# Altium schematic sheet Artic.SchDoc
size 431 x 279 mm; DocumentNumber: 2; SheetNumber: 2; SheetTotal: 7
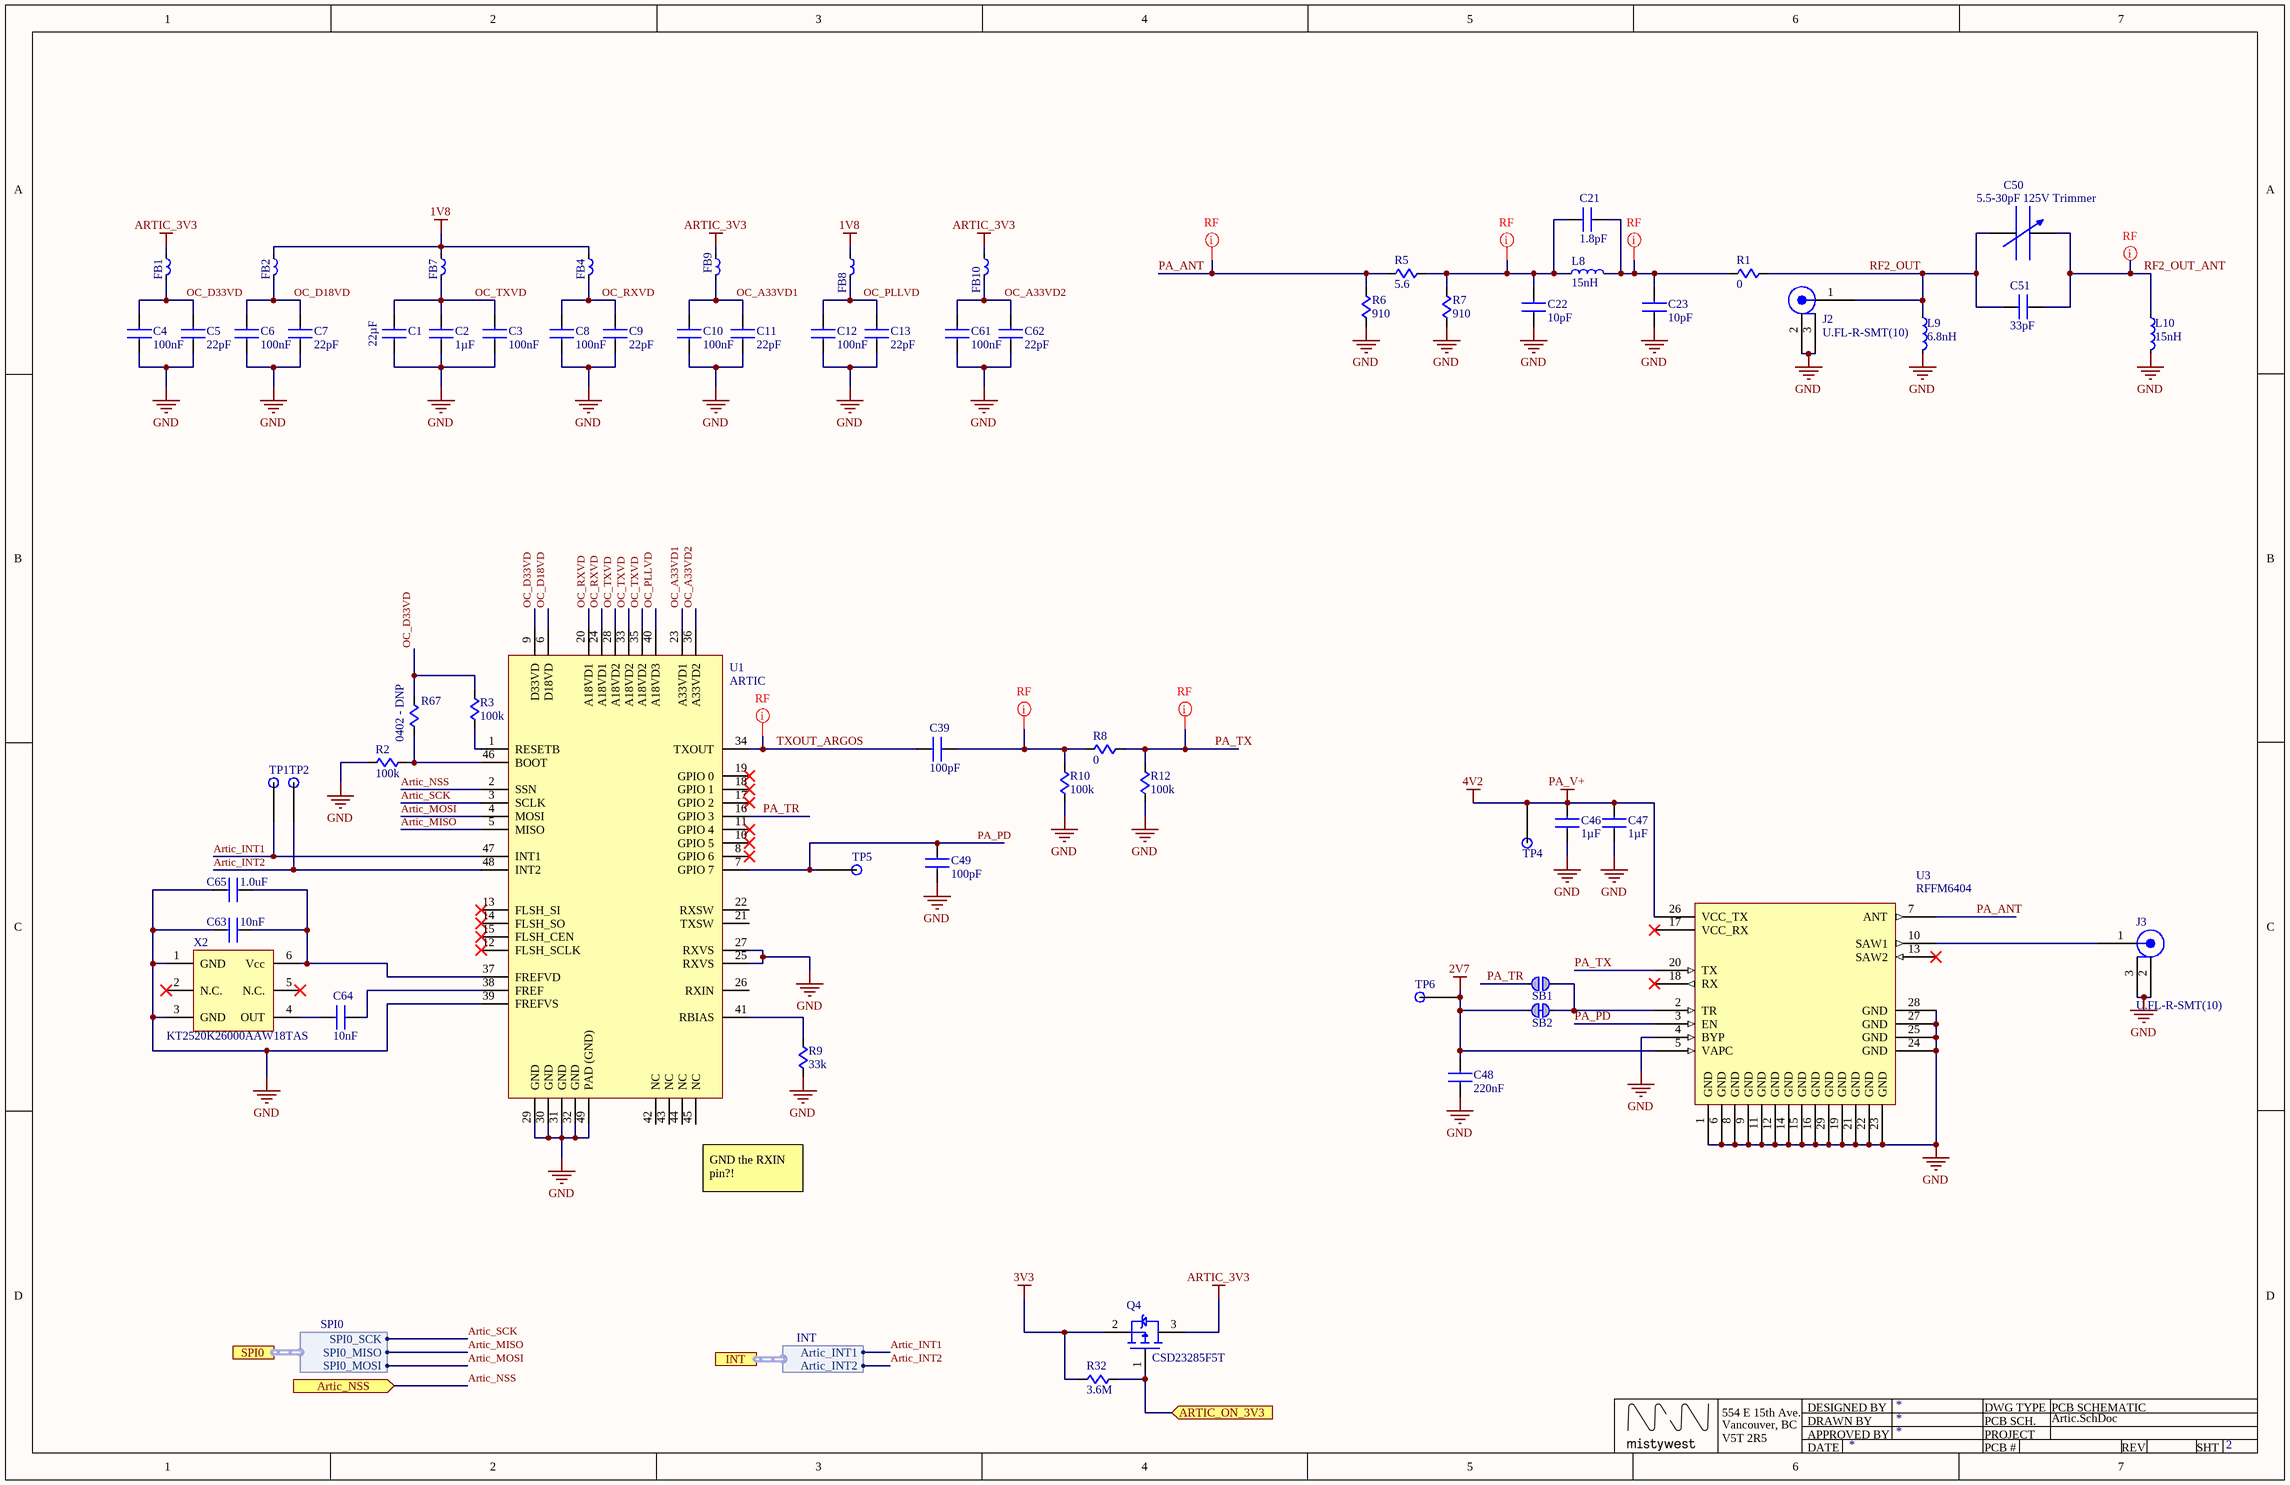
[diagram p0: Artic.SchDoc]

## Parts
C1  22µF  [CAPC1608N-0603]
C2  1µF  [CAPC1005N-0402]
C3  100nF  [CAPC1005N-0402]
C4  100nF  [CAPC1005N-0402]
C5  22pF  [CAPC1005N-0402]
C6  100nF  [CAPC1005N-0402]
C7  22pF  [CAPC1005N-0402]
C8  100nF  [CAPC1005N-0402]
C9  22pF  [CAPC1005N-0402]
C10  100nF  [CAPC1005N-0402]
C11  22pF  [CAPC1005N-0402]
C12  100nF  [CAPC1005N-0402]
C13  22pF  [CAPC1005N-0402]
C21  1.8pF  [CAPC1005N-0402]
C22  10pF  [CAPC1005N-0402]
C23  10pF  [CAPC1005N-0402]
C39  100pF  [CAPC1005N-0402]
C46  1µF  [CAPC1005N-0402]
C47  1µF  [CAPC1005N-0402]
C48  220nF  [CAPC1005N-0402]
C49  100pF  [CAPC1005N-0402]
C50  5.5-30pF 125V Trimmer  [CAPC4531X17N]
C51  33pF  [CAPC1005N-0402]
C61  100nF  [CAPC1005N-0402]
C62  22pF  [CAPC1005N-0402]
C63  10nF  [CAPC1005N-0402]
C64  10nF  [CAPC1005N-0402]
C65  1.0uF  [CAPC1608N-0603]
FB1  BLM15AG221SN1D  [MURA-BLM15-CHIP-2_V]  (value not drawn)
FB2  BLM15AG221SN1D  [MURA-BLM15-CHIP-2_V]  (value not drawn)
FB4  BLM15AG221SN1D  [MURA-BLM15-CHIP-2_V]  (value not drawn)
FB7  BLM15AG221SN1D  [MURA-BLM15-CHIP-2_V]  (value not drawn)
FB8  BLM15AG221SN1D  [MURA-BLM15-CHIP-2_V]  (value not drawn)
FB9  BLM15AG221SN1D  [MURA-BLM15-CHIP-2_V]  (value not drawn)
FB10  BLM15AG221SN1D  [MURA-BLM15-CHIP-2_V]  (value not drawn)
J2  mfg_pn: U.FL-R-SMT(10)  [con_hrs_U_FL-SMT]  (hidden comment: CONNECTOR COAX-M 2GND)
J3  mfg_pn: U.FL-R-SMT(10)  [con_hrs_U_FL-SMT]  (hidden comment: CONNECTOR COAX-M 2GND)
L8  15nH  [LQW2BA]
L9  6.8nH  [0603HP]
L10  15nH  [0603HP]
Q4  CSD23285F5T  [3-XFDFN]
R1  0  [RESC0402(1005)_N]
R2  100k  [RESC0402(1005)_N]
R3  100k  [RESC0402(1005)_N]
R5  5.6  [Chip Res 1608_0603 MMC]
R6  910  [Chip Res 1608_0603 MMC]
R7  910  [Chip Res 1608_0603 MMC]
R8  0  [RESC0402(1005)_N]
R9  33k  [RESC0402(1005)_N]
R10  100k  [RESC0402(1005)_N]
R12  100k  [RESC0402(1005)_N]
R32  3.6M  [RESC0402(1005)_N]
R67  0402 - DNP  [RESC0402(1005)_N]  (no BOM)
SB1  Solder Bridge Open - 50mil  [Solder_Bridge_Open_50]  (value not drawn)  (net tie, no BOM)
SB2  Solder Bridge Closed - 50mil  [Solder_Bridge_Closed_50]  (value not drawn)  (net tie, no BOM)
TP1  (no value)  [Testpoint_16mil_32mil]  (no BOM)
TP2  (no value)  [Testpoint_16mil_32mil]  (no BOM)
TP4  (no value)  [Testpoint_16mil_32mil]  (no BOM)
TP5  (no value)  [Testpoint_16mil_32mil]  (no BOM)
TP6  (no value)  [Testpoint_16mil_32mil]  (no BOM)
U1  ARTIC  [QFN, 48-Lead]
U3  RFFM6404  [LGA28C100P8X8_600X600X105]
X2  KT2520K26000AAW18TAS  [KT2520]

## Ports
Artic_NSS (in), ARTIC_ON_3V3 (in), INT (harness INT), SPI0 (harness SPI0)

## Harnesses
SPI0: SPI0_SCK, SPI0_MISO, SPI0_MOSI
INT: Artic_INT1, Artic_INT2

## Nets
1V8: FB2.1 FB4.1 FB7.1 FB8.1
2V7: C48.1 SB2.2 TP6.TP U3.5(VAPC)
3V3: Q4.2(Source) R32.1
4V2: C46.1 C47.1 TP4.TP U3.26(VCC_TX)  [also labelled PA_V+]
ARTIC_3V3: FB1.1 FB9.1 FB10.1 Q4.3(Drain)
GND: C1.2 C2.2 C3.2 C4.2 C5.2 C6.2 C7.2 C8.2 C9.2 C10.2 C11.2 C12.2 C13.2 C22.2 C23.2 C46.2 C47.2 C48.2 C49.1 C61.2 C62.2 C63.1 C65.1 J2.2(SHIELD) J2.3(SHIELD2) J3.2(SHIELD) J3.3(SHIELD2) L9.2 L10.2 R2.2 R6.1 R7.1 R9.1 R10.1 R12.1 U1.25(RXVS) U1.27(RXVS) U1.29(GND) U1.30(GND) U1.31(GND) U1.32(GND) U1.39(FREFVS) U1.49(PAD_(GND)) U3.1(GND) U3.4(BYP) U3.6(GND) U3.8(GND) U3.9(GND) U3.11(GND) U3.12(GND) U3.14(GND) U3.15(GND) U3.16(GND) U3.19(GND) U3.21(GND) U3.22(GND) U3.23(GND) U3.24(GND) U3.25(GND) U3.27(GND) U3.28(GND) U3.29(GND) X2.1(GND) X2.3(GND)
Artic_INT1: TP1.TP U1.47(INT1) ; port INT.Artic_INT1
Artic_INT2: TP2.TP U1.48(INT2) ; port INT.Artic_INT2
Artic_MISO: U1.5(MISO) ; port SPI0.SPI0_MISO
Artic_MOSI: U1.4(MOSI) ; port SPI0.SPI0_MOSI
Artic_NSS: U1.2(SSN) ; port Artic_NSS
ARTIC_ON_3V3: Q4.1(Gate) R32.2 ; port ARTIC_ON_3V3
Artic_SCK: U1.3(SCLK) ; port SPI0.SPI0_SCK
OC_A33VD1: C10.1 C11.1 FB9.2 U1.23(A33VD1)
OC_A33VD2: C61.1 C62.1 FB10.2 U1.36(A33VD2)
OC_D18VD: C6.1 C7.1 FB2.2 U1.6(D18VD)
OC_D33VD: C4.1 C5.1 FB1.2 R3.2 R67.2 U1.9(D33VD)
OC_PLLVD: C12.1 C13.1 FB8.2 U1.40(A18VD3)
OC_RXVD: C8.1 C9.1 FB4.2 U1.20(A18VD1) U1.24(A18VD1)
OC_TXVD: C1.1 C2.1 C3.1 FB7.2 U1.28(A18VD2) U1.33(A18VD2) U1.35(A18VD2)
PA_ANT: R5.1 R6.2 U3.7(ANT)
PA_PD: C49.2 TP5.TP U1.7(GPIO_7) U3.3(EN)
PA_TR: SB1.2 U1.16(GPIO_3)
PA_TX: R8.2 R12.2 U3.20(TX)
RF2_OUT: C50.1 C51.1 J2.1(CENTER) L9.1 R1.2
RF2_OUT_ANT: C50.2 C51.2 L10.1
TXOUT_ARGOS: C39.1 U1.34(TXOUT)
NetC21_1: C21.1 C22.1 L8.1 R5.2 R7.2
NetC21_2: C21.2 C23.1 L8.2 R1.1
NetC39_2: C39.2 R8.1 R10.2
NetC63_2: C63.2 C65.2 U1.37(FREFVD) X2.6(Vcc)
NetC64_1: C64.1 X2.4(OUT)
NetC64_2: C64.2 U1.38(FREF)
NetJ3_1: J3.1(CENTER) U3.10(SAW1)
NetR2_1: R2.1 R67.1 U1.46(BOOT)
NetR3_1: R3.1 U1.1(RESETB)
NetR9_2: R9.2 U1.41(RBIAS)
NetSB1_1: SB1.1 SB2.1 U3.2(TR)

Not connected (* = marked no-connect by the designer): U1 8(GPIO_6)* 10(GPIO_5)* 11(GPIO_4)* 12(FLSH_SCLK)* 13(FLSH_SI)* 14(FLSH_SO)* 15(FLSH_CEN)* 17(GPIO_2)* 18(GPIO_1)* 19(GPIO_0)* 21(TXSW) 22(RXSW) 26(RXIN) 42(NC) 43(NC) 44(NC) 45(NC); U3 13(SAW2)* 17(VCC_RX)* 18(RX)*; X2 2(N.C.)* 5(N.C.)*

## Layout directives
net class RF: NetC21_1, NetC21_2, NetC39_2, PA_ANT, PA_TX, RF2_OUT_ANT, TXOUT_ARGOS

## Notes on the sheet
- (near U1) GND the RXIN pin?!
- 554 E 15th Ave.
- Vancouver, BC
- PCB SCHEMATIC
- V5T 2R5
- DESIGNED BY
  DRAWN BY
  APPROVED BY
  DATE
- DWG TYPE
  PCB SCH.
  PROJECT
  PCB #
- REV  =Revision
- SHT  =SheetNumber OF =SheetTotal

## Library data of the parts
C1 = CMP-03705-2: CAP CER 22UF 6.3V X5R 0603 ±10%; Manufacturer: Samsung Electro-Mechanics America, Inc.; Manufacturer Part Number: CL10A226KQ8NRNE; Capacitance: 22µF; Temperature Coefficient: X5R; Tolerance: ±10%; Voltage: 6.3V
C2 C46 C47 = CMP-02706-4: CAP CER 1UF 6.3V X7R 0402 ±10%; Manufacturer: Samsung Electro-Mechanics America, Inc.; Manufacturer Part Number: CL05B105KQ5NQNC; RevisionId: 2; AccessRights: 2147483647; Folder: MW_Parts\Components\Capacitors\Ceramic\Ceramic Filters\0402\X7R\; ContentType: Component; AncestorItemRevisionGUID: FD93AFD0-5032-408C-A550-1F4FCEC40B04; LifeCycleStateGUID: 706004B5-C76E-482E-903B-BA0E4FAE086A; ReleaseDate: 21/08/2017 11:02:52 PM; ContentTypeGUID: CB3C11C4-E317-11DF-B822-12313F0024A2; ItemGUID: 5B2E3594-B687-4FDE-A8F8-DCF9F15A9421; ItemHRID: CMP-02706; FolderGUID: EC3CA227-945F-4B62-A70C-0C1E94DF012A; LifeCycle: Draft; ComponentType: Capacitor; Capacitance: 1µF; Temperature Coefficient: X7R; Tolerance: ±10%; Voltage: 6.3V
C3 C4 C6 C8 C10 C12 C61 = CMP-02680-4: CAP CER 0.1UF 10V X7R 0402 ±5%; Manufacturer: Samsung Electro-Mechanics America, Inc.; Manufacturer Part Number: CL05B104JP5NNNC; RevisionId: 2; AccessRights: 2147483647; Folder: MW_Parts\Components\Capacitors\Ceramic\Ceramic Filters\0402\X7R\; ContentType: Component; AncestorItemRevisionGUID: B5B9AEA9-2888-4609-98C5-D2A143A2E055; LifeCycleStateGUID: 706004B5-C76E-482E-903B-BA0E4FAE086A; ReleaseDate: 21/08/2017 11:02:50 PM; ContentTypeGUID: CB3C11C4-E317-11DF-B822-12313F0024A2; ItemGUID: 98D0CBC0-CD69-4B1B-A7E9-949A7B6C034B; ItemHRID: CMP-02680; FolderGUID: EC3CA227-945F-4B62-A70C-0C1E94DF012A; LifeCycle: Draft; ComponentType: Capacitor; Capacitance: 100nF; Temperature Coefficient: X7R; Tolerance: ±5%; Voltage: 10V
C5 C7 C9 C11 C13 C62 = CMP-02804-2: CAP CER 22PF 50V C0G/NP0 0402 ±5%; Manufacturer: Samsung Electro-Mechanics America, Inc.; Manufacturer Part Number: CL05C220JB5NNNC; Temperature Coefficient: C0G, NP0; Capacitance: 22pF; Tolerance: ±5%; Voltage: 50V
C21 = CMP-02769-2: CAP CER 1.8PF 50V C0G/NP0 0402 ±0.25pF; Manufacturer: Samsung Electro-Mechanics America, Inc.; Manufacturer Part Number: CL05C1R8CB5NNNC; Temperature Coefficient: C0G, NP0; Capacitance: 1.8pF; Tolerance: ±0.25pF; Voltage: 50V
C22 C23 = CMP-02776-2: CAP CER 10PF 50V C0G/NP0 0402 ±0.25pF; Manufacturer: Samsung Electro-Mechanics America, Inc.; Manufacturer Part Number: CL05C100CB5NNNC; Temperature Coefficient: C0G, NP0; Capacitance: 10pF; Tolerance: ±0.25pF; Voltage: 50V
C39 C49 = CMP-02879-2: CAP CER 100PF 50V C0G/NP0 0402 ±5% AEC-Q200; Manufacturer: Samsung Electro-Mechanics America, Inc.; Manufacturer Part Number: CL05C101JB51PNC; Temperature Coefficient: C0G, NP0; Capacitance: 100pF; Tolerance: ±5%; Voltage: 50V
C48 = CMP-02685-4: CAP CER 0.22UF 10V X7R 0402 ±10%; Manufacturer: Samsung Electro-Mechanics America, Inc.; Manufacturer Part Number: CL05B224KP5NNNC; RevisionId: 2; AccessRights: 2147483647; Folder: MW_Parts\Components\Capacitors\Ceramic\Ceramic Filters\0402\X7R\; ContentType: Component; AncestorItemRevisionGUID: 19ED1FDF-9501-448A-B921-9E0B872992DD; LifeCycleStateGUID: 706004B5-C76E-482E-903B-BA0E4FAE086A; ReleaseDate: 21/08/2017 11:02:36 PM; ContentTypeGUID: CB3C11C4-E317-11DF-B822-12313F0024A2; ItemGUID: F74CCC9D-90D1-403A-981F-F79E304EBD0F; ItemHRID: CMP-02685; FolderGUID: EC3CA227-945F-4B62-A70C-0C1E94DF012A; LifeCycle: Draft; ComponentType: Capacitor; Capacitance: 220nF; Temperature Coefficient: X7R; Tolerance: ±10%; Voltage: 10V
C50 = CMP-04735-1: CAP TRIMMER 5.5-30PF 125V SMD; Manufacturer: Knowles Voltronics; Manufacturer Part Number: JR300; Capacitance: 30pF; Temperature Coefficient: -1500 +/- 1000; Tolerance: + 100% - 0%; Voltage Rating: 100V; Q Factor: 1500; Test Frequency: 1MHz; Voltage: 125V; Min Operating Temperature: -40°C; Max Operating Temperature: 85°C; Packaging: Tape and Reel; Package Quantity: 1000; Termination: SMD/SMT; Resistor Type: Ceramic; Voltage Rating (DC): 100V; Length: 0.138inch; Height: 0.045inch; Width: 0.122inch
C51 = CMP-02818-2: CAP CER 33PF 50V C0G/NP0 0402 ±5%; Manufacturer: Samsung Electro-Mechanics America, Inc.; Manufacturer Part Number: CL05C330JB5NNNC; Temperature Coefficient: C0G, NP0; Tolerance: ±5%; Voltage: 50V; Capacitance: 33pF
C63 C64 = CMP-02688-4: CAP CER 10000PF 10V X7R 0402 ±10%; Manufacturer: Samsung Electro-Mechanics America, Inc.; Manufacturer Part Number: CL05B103KP5NNNC; RevisionId: 2; AccessRights: 2147483647; Folder: MW_Parts\Components\Capacitors\Ceramic\Ceramic Filters\0402\X7R\; ContentType: Component; AncestorItemRevisionGUID: FBEF5854-9E39-482B-85E2-851CE328D631; LifeCycleStateGUID: 706004B5-C76E-482E-903B-BA0E4FAE086A; ReleaseDate: 21/08/2017 11:02:51 PM; ContentTypeGUID: CB3C11C4-E317-11DF-B822-12313F0024A2; ItemGUID: 32F95929-C4EE-43CA-91BC-E7F6B815331F; ItemHRID: CMP-02688; FolderGUID: EC3CA227-945F-4B62-A70C-0C1E94DF012A; LifeCycle: Draft; ComponentType: Capacitor; Capacitance: 10nF; Temperature Coefficient: X7R; Tolerance: ±10%; Voltage: 10V
C65 = CMP-00018-5: CAP CER 1.0uF 6.3V X7R 0603 ±10%; Manufacturer: Samsung Electro-Mechanics America, Inc.; Manufacturer Part Number: CL10B105KQ8NNN; Capacitance: 1µF; Temperature Coefficient: X7R; Voltage: 6.3V; Tolerance: ±10%
FB1 FB2 FB4 FB7-FB10 = CMP-04113-4: Chip Ferrite Bead for General Use, 220 Ohm, 450 mA, -55 to 125 degC, 1 x 0.5 x 0.55 mm SMD, Tape and Reel; Manufacturer: Murata; Manufacturer Part Number: BLM15AG221SN1D
J2 J3 = CMP-008-0021-3: CONN RECPT ULTRA-MINI COAX SMD; dist: DIGIKEY; dist_pn: H9161CT-ND; mfg: HIROSE; positions: 1; source_package: U_FL; Body Material: Bronze; Plating: Silver; Dielectric Material: Polymer; Impedance: 50R; Connector Type: Coaxial,Receptacle,Male Pin; Max Frequency: 6GHz; Component Name: CONNECTOR COAX-M 2GND; height: 1.25MM; part_type: connector; status: Unknown; Manufacturer: HIROSE; Manufacturer Part Number: U.FL-R-SMT(10); Mount: Surface Mount; Case/Package: SMD/SMT; Contact Material: Brass; Contact Plating: Gold; Body Plating: Silver; Housing Color: Beige; Min Operating Temperature: -40°C; Max Operating Temperature: 90°C; Package Quantity: 1; Fastening Type: Snap; Packaging: Tape and Reel; Termination: Solder; Frequency: 6GHz; Orientation: Vertical; Length: 3mm; Depth: 3.1mm; Radiation Hardening: No; Lead Free: Lead Free
L8 = CMP-04583-1: FIXED IND 15NH 1.5A 120 MOHM; Manufacturer: MuRata; Manufacturer Part Number: LQW2BAN15NG00L; DC Resistance: 0.12; Current Rating: 1.5A; Inductance: 15nH
L9 = CMP-04134-2: 0603HP-6N8X_E_; Manufacturer: Coilcraft; Current Rating: 1.4A; DC Resistance: 42m; Inductance: 6.8nH; Manufacturer Part Number: 0603HP-6N8X_E_
L10 = CMP-04144-2: 0603HP-15NX_E_; Manufacturer: Coilcraft; Current Rating: 1.2A; DC Resistance: 78m; Inductance: 15nH; Manufacturer Part Number: 0603HP-15NX_E_
Q4 = CMP-04199-1: P-Channel 12V 5.4A (Ta) 500mW (Ta) Surface Mount 3-PICOSTAR; Manufacturer: Texas Instruments; Ciss: 628pF @ 6V; Id (25C): 4.5A; Rds On: 34mOhm; Manufacturer Part Number: CSD23285F5T; Power - Max: 500mW (Ta); Vdss: 12V
R1 R8 = CMP-02011-4: RES SMD 0.0OHM JUMPER 1/16W 0402; Manufacturer: Yageo; Manufacturer Part Number: RC0402JR-070RL; RevisionId: 3; AccessRights: 2147483647; Folder: MW_Parts\Components\Resistors\0402\; ContentType: Component; Power: 1/16; LifeCycleStateGUID: 706004B5-C76E-482E-903B-BA0E4FAE086A; ReleaseDate: 16/08/2017 05:04:55 PM; ContentTypeGUID: CB3C11C4-E317-11DF-B822-12313F0024A2; ItemGUID: EB0E4010-FD26-4F9E-B9EF-C7D1A7F136A7; ItemHRID: CMP-02011; FolderGUID: FF00D775-EA76-40F5-8F49-C5946BC46B28; LifeCycle: Draft; ComponentType: Resistor; Resistance: 0
R2 R3 R10 R12 = CMP-00156-2: RES SMD 100K OHM 1% 1/10W 0402; Manufacturer: Panasonic Electronic Components; Manufacturer Part Number: ERJ-2RKF1003X; RevisionId: 1; AccessRights: 2147483647; Folder: MW_Parts\Components\Resistors\0402\; ContentType: Component; Power: 0.1W, 1/10W; LifeCycleStateGUID: 706004B5-C76E-482E-903B-BA0E4FAE086A; ReleaseDate: 14/08/2017 09:06:11 PM; ContentTypeGUID: CB3C11C4-E317-11DF-B822-12313F0024A2; ItemGUID: 08BEA0BF-03A0-4565-A69F-37255C0633B6; ItemHRID: CMP-00156; FolderGUID: FF00D775-EA76-40F5-8F49-C5946BC46B28; LifeCycle: Draft; ComponentType: Resistor; Resistance: 100k; Tolerance: ±1%
R5 = CMP-04727-1: RES SMD 5.6 OHM 1% 1/4W 0603; Manufacturer: Panasonic; Manufacturer Part Number: ERJ-3BQF5R6V; Power: 0.2W; Power Rating: 200mW; Temperature Coefficient: 200ppm/°C; Max Power Dissipation: 250mW; Resistance: 5.6; Tolerance: 1%; Mount: Surface Mount; Case/Package: 0603; Number of Pins: 2; Weight: 7.1E-05oz; Case Code (Imperial): 0603; Case Code (Metric): 1608; Contact Plating: Tin; Min Operating Temperature: -55°C; Max Operating Temperature: 125°C; Packaging: Tape and Reel; Package Quantity: 5000; Composition: Thick Film,Low-Ohm-Resistor; Termination: SMD/SMT; Number of Terminations: 2; Military Standard: Not; Features: Automotive AEC-Q200; Length: 1.6mm; Height: 0.45mm; Width: 0.8mm; Depth: 0.8mm; Radiation Hardening: No; REACH SVHC: No SVHC
R6 R7 = CMP-04725-1: PANASONIC   ERJPA3F9100V   RESISTOR, ERJP, 910 OHM, 0603, 0.25W, 1%; Manufacturer Part Number: ERJ-PA3F9100V; Power Rating: 250mW; Voltage Rating: 150V; Temperature Coefficient: 100ppm/°C; Manufacturer: Panasonic; Power: 0.25W; Resistance: 910; Tolerance: 1%; Mount: Surface Mount; Case/Package: 0603; Case Code (Metric): 1608; Case Code (Imperial): 0603; Min Operating Temperature: -55°C; Max Operating Temperature: 155°C; Composition: Thick Film; Packaging: Cut Tape; Number of Terminations: 2; Termination: Solder; Max Power Dissipation: 250mW; Voltage Rating (DC): 150V; Features: Automotive AEC-Q200; Length: 0.063inch; Height: 0.018inch; Width: 0.031inch; Depth: 0.8mm; REACH SVHC: No SVHC
R9 = CMP-02260-2: RES SMD 33K OHM 1% 1/10W 0402; Manufacturer: Panasonic Electronic Components; Manufacturer Part Number: ERJ-2RKF3302X; RevisionId: 1; AccessRights: 2147483647; Folder: MW_Parts\Components\Resistors\0402\; ContentType: Component; Power: 0.1W, 1/10W; LifeCycleStateGUID: 706004B5-C76E-482E-903B-BA0E4FAE086A; ReleaseDate: 14/08/2017 09:07:33 PM; ContentTypeGUID: CB3C11C4-E317-11DF-B822-12313F0024A2; ItemGUID: F3BD2F28-1D5D-4F03-9486-E4B48CB21079; ItemHRID: CMP-02260; FolderGUID: FF00D775-EA76-40F5-8F49-C5946BC46B28; LifeCycle: Draft; ComponentType: Resistor; Resistance: 33k; Tolerance: ±1%
R32 = CMP-02536-2: RES SMD 3.6M OHM 1% 1/16W 0402; Manufacturer: Yageo; Manufacturer Part Number: RC0402FR-073M6L; RevisionId: 1; AccessRights: 2147483647; Folder: MW_Parts\Components\Resistors\0402\; ContentType: Component; Power: 0.063W, 1/16W; LifeCycleStateGUID: 706004B5-C76E-482E-903B-BA0E4FAE086A; ReleaseDate: 14/08/2017 09:06:44 PM; ContentTypeGUID: CB3C11C4-E317-11DF-B822-12313F0024A2; ItemGUID: 8734D7F0-F7B6-4093-81FA-6769CE3BA6FB; ItemHRID: CMP-02536; FolderGUID: FF00D775-EA76-40F5-8F49-C5946BC46B28; LifeCycle: Draft; ComponentType: Resistor; Resistance: 3.6M; Tolerance: ±1%
R67 = CMP-001-0000-1: Resistance: ∞
SB1 = CMP-ROOT-0027-4: Open Solder Bridge (50mil size); RevisionId: 1; AccessRights: 2147483647; Folder: MW_Parts\Components\PCB Artwork (Net Ties, Logos, Fiducials, Easter Eggs, Etc.)\Solder Bridges\; ContentType: Component; LifeCycleStateGUID: 706004B5-C76E-482E-903B-BA0E4FAE086A; ReleaseDate: 23/08/2017 05:08:00 PM; ContentTypeGUID: CB3C11C4-E317-11DF-B822-12313F0024A2; ItemGUID: DF0DBBC9-733C-4C5C-ADE9-5EBA3318418A; ItemHRID: CMP-ROOT-0027; FolderGUID: 7CD9CA14-3C45-4852-9169-40DC6F0FDA37; LifeCycle: Draft
SB2 = CMP-ROOT-0028-5: Closed Solder Bridge (50mil size); RevisionId: 1; AccessRights: 2147483647; Folder: MW_Parts\Components\PCB Artwork (Net Ties, Logos, Fiducials, Easter Eggs, Etc.)\Solder Bridges\; ContentType: Component; LifeCycleStateGUID: 706004B5-C76E-482E-903B-BA0E4FAE086A; ReleaseDate: 23/08/2017 05:08:00 PM; ContentTypeGUID: CB3C11C4-E317-11DF-B822-12313F0024A2; ItemGUID: 73A36697-90B2-4800-A05E-B38AF660EF56; ItemHRID: CMP-ROOT-0028; FolderGUID: 7CD9CA14-3C45-4852-9169-40DC6F0FDA37; LifeCycle: Draft
TP1 TP2 TP4-TP6 = CMP-ROOT-0023-4: Test Point - 16mil/32mil via; RevisionId: 3; AccessRights: 2147483647; Folder: MW_Parts\Components\PCB Artwork (Logos, Fiducials, Easter Eggs, Etc.)\Test Points\; ContentType: Component; AncestorItemRevisionGUID: 75AF5AD0-AC2E-461C-A712-52160B1E82C4; LifeCycleStateGUID: 706004B5-C76E-482E-903B-BA0E4FAE086A; ReleaseDate: 23/08/2017 03:25:20 AM; ContentTypeGUID: CB3C11C4-E317-11DF-B822-12313F0024A2; ItemGUID: 542E3FDF-05CE-4787-ACB6-AECCF613BD0E; ItemHRID: CMP-ROOT-0023; FolderGUID: 826AF0AF-D3B5-4CC2-AA9D-34285EE49F0B; LifeCycle: Draft
U1 = CMP-011-0000-4: Ansem ARTIC; Manufacturer: Ansem; Manufacturer Part Number: ARTIC
U3 = CMP-04726-7: Transmit/Receive Module, 2.5V to 4.5V, ISM Band, 27.5dBm, 430MHz to 450MHz; Manufacturer: Qorvo; Manufacturer Part Number: RFFM6404TR13
X2 = CMP-04255-1: 26MHz TCXO Clipped Sine Wave Oscillator 1.8V 6-SMD, No Lead; Manufacturer: Kyocera International Inc. Electronic Components; Manufacturer Part Number: KT2520K26000AAW18TAS